# EAGLE schematic CAAint (EAGLE 8.4.0)
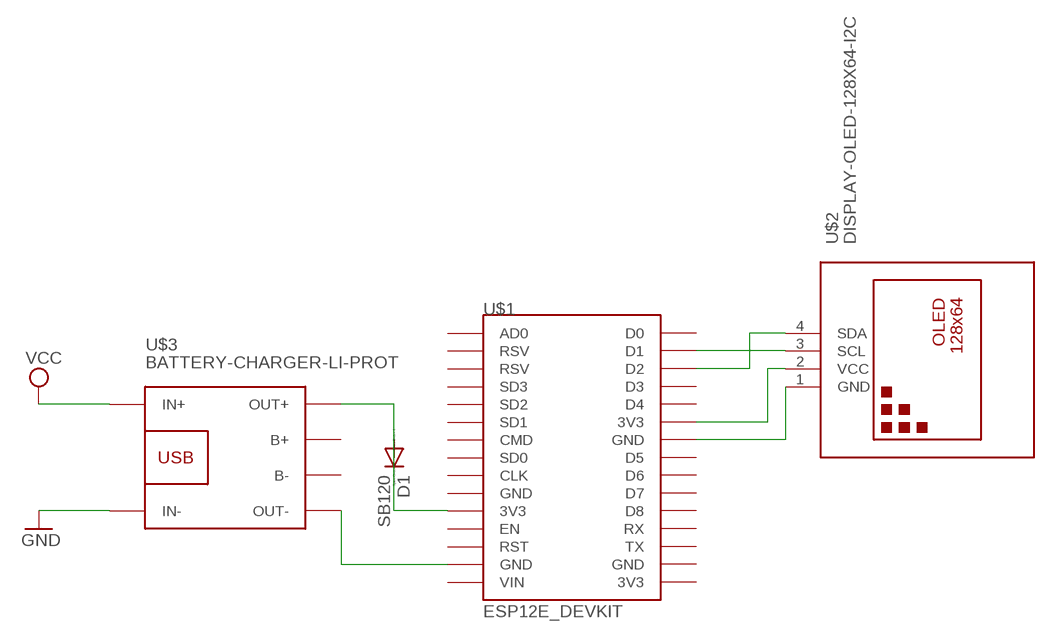
[diagram p0: schematic, sheet 1]

## Parts
D1  SB120  [DO41-10]
U$1  ESP12E_DEVKIT  [ESP12E_DEVKIT]
U$2  DISPLAY-OLED-128X64-I2C  [DISPLAY-OLED-128X64-I2C]
U$3  BATTERY-CHARGER-LI-PROT  [BATTERY-CHARGER-LI-PROT]

## Nets
D1: D1.A U$1.3V3@0(3V3)
GND: U$1.GND@1(GND) U$1.GND@2(GND) U$2.1(GND) U$3.IN- U$3.OUT-
N$1: U$1.D2 U$2.4(SDA)
N$2: U$1.D1 U$2.3(SCL)
N$3: U$1.3V3@1(3V3) U$2.2(VCC)
N$6: D1.C U$3.OUT+
VCC: U$3.IN+
Unconnected: U$1.3V3@2(3V3) U$1.AD0 U$1.CLK U$1.CMD U$1.D0 U$1.D3 U$1.D4 U$1.D5 U$1.D6 U$1.D7 U$1.D8 U$1.EN U$1.GND@0(GND) U$1.GND@3(GND) U$1.RST U$1.RSV@0(RSV) U$1.RSV@1(RSV) U$1.RX U$1.SD0 U$1.SD1 U$1.SD2 U$1.SD3 U$1.TX U$1.VIN U$3.B+ U$3.B-

## Library data of the parts
D1 = diode:SB120: DIODE barrier rectifier, 1 A (Fairchild)
U$1 = ESP12E_DEVKIT:ESP12E_DEVKIT: ESP12E DEVKIT BOARD
U$2 = diy-modules:DISPLAY-OLED-128X64-I2C: 128x64 Dot Matrix OLED Module based on SSD1306 chip Variant with I2C interface More details available here: http://www.instructables.com/id/Monochrome-096-i2c-OLED-display-with-arduino-SSD13/ SSD1306 datasheet: https://cdn-shop.adafruit.com/datasheets/SSD1306.pdf Click here to find device on ebay.com <http://www.ebay.com/sch/oled+display+128x64+iic> Note: There are two variants: I2C and SPI. Search for the proper version.
U$3 = diy-modules:BATTERY-CHARGER-LI-PROT: Lithium Battery 5V Charger with protection circuit More details available here: http://www.instructables.com/id/DIY-Lithium-ion-Battery-Charger/step4/TP4056-based-lithium-ion-battery-charger-module/ Click here to find device on ebay.com <http://www.ebay.com/sch/tp4056+charger+usb+protection>